# Altium project USBHub.PrjPcb
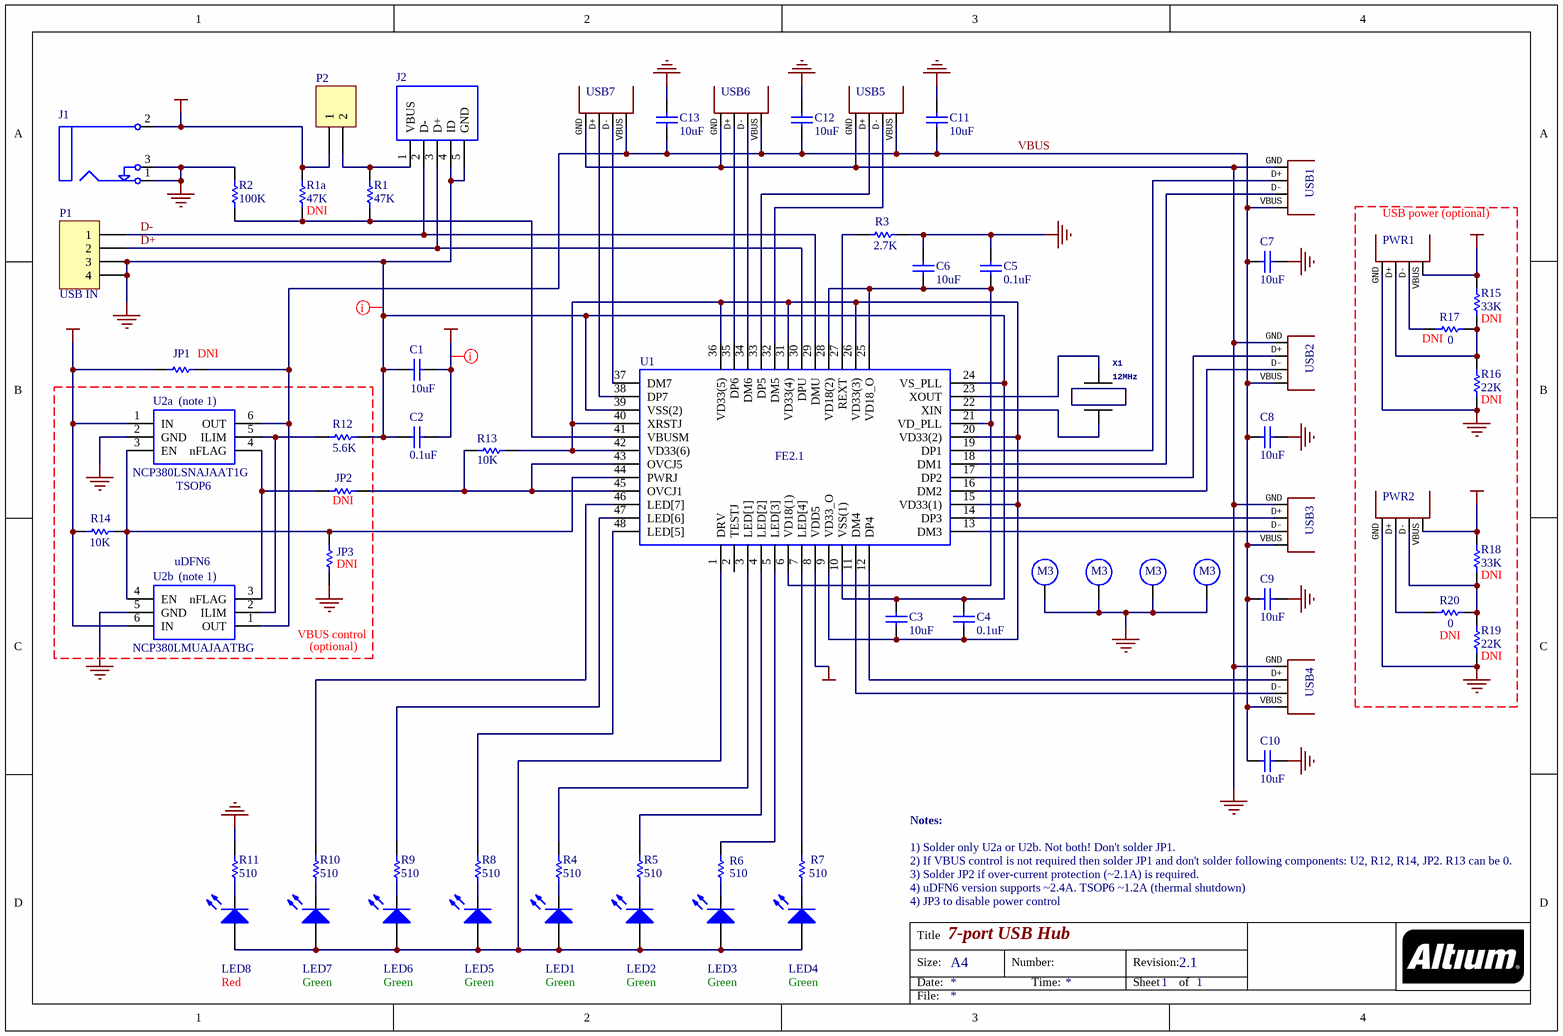
[diagram p0: USBHub.SchDoc]
1 sheet, 66 parts. Net scope: global (net labels, ports and power ports of the same name join across sheets).
Board file: USBHub.PcbDoc

## Sheet USBHub.SchDoc: 7-port USB Hub
size A4; Author: Sorgelig; Revision: 2.1; SheetNumber: 1; SheetTotal: 1

### Parts
C1  value 10uF  [C0805]  (hidden comment: C0805)
C2  value 0.1uF  [C0805]  (hidden comment: C0805)
C3  value 10uF  [C0805]  (hidden comment: C0805)
C4  value 0.1uF  [C0805]  (hidden comment: C0805)
C5  value 0.1uF  [C0805]  (hidden comment: C0805)
C6  value 10uF  [C0805]  (hidden comment: C0805)
C7  value 10uF  [C0805]  (hidden comment: C0805)
C8  value 10uF  [C0805]  (hidden comment: C0805)
C9  value 10uF  [C0805]  (hidden comment: C0805)
C10  value 10uF  [C0805]  (hidden comment: C0805)
C11  value 10uF  [C0805]  (hidden comment: C0805)
C12  value 10uF  [C0805]  (hidden comment: C0805)
C13  value 10uF  [C0805]  (hidden comment: C0805)
H1  M3  [M3]  (value not drawn)
H2  M3  [M3]  (value not drawn)
H3  M3  [M3]  (value not drawn)
H4  M3  [M3]  (value not drawn)
J1  *  [PWR-2mm - DNI]  (value not drawn)
J2  MicroUSB SMT  [MicroUSB SMT v2]  (value not drawn)
JP1  0  [R0805 - DNI]  (value not drawn)
JP2  0  [R0805 - DNI]  (value not drawn)
JP3  0  [R0805 - DNI]  (value not drawn)
LED1  Green  [LEDG0805]
LED2  Green  [LEDG0805]
LED3  Green  [LEDG0805]
LED4  Green  [LEDG0805]
LED5  Green  [LEDG0805]
LED6  Green  [LEDG0805]
LED7  Green  [LEDG0805]
LED8  Red  [LEDR0805]
P1  USB IN  [HDR1X4]
P2  Header 2  [HDR1X2]  (value not drawn)
PWR1  USBA-PTH  [USB-A-F-PTH]  (value not drawn)
PWR2  USBA-PTH  [USB-A-F-PTH]  (value not drawn)
R1  47K  [R0805]
R1a  47K  [R0805 - DNI]
R2  100K  [R0805]
R3  2.7K  [R0805]
R4  510  [R0805]
R5  510  [R0805]
R6  510  [R0805]
R7  510  [R0805]
R8  510  [R0805]
R9  510  [R0805]
R10  510  [R0805]
R11  510  [R0805]
R12  5.6K  [R0805]
R13  10K  [R0805]
R14  10K  [R0805]
R15  33K  [R0805 - DNI]
R16  22K  [R0805 - DNI]
R17  0  [R0805 - DNI]
R18  33K  [R0805 - DNI]
R19  22K  [R0805 - DNI]
R20  0  [R0805 - DNI]
U1  FE2.1  [LQFP48]
U2a  TSOP6  Manufacturer_Part_Number: NCP380LSNAJAAT1G  [SOT23-6_L]
U2b  uDFN6  Manufacturer_Part_Number: NCP380LMUAJAATBG  [uDFN6 2x2mm]
USB1  USBA-PTH  [USB-A-F-PTH]  (value not drawn)
USB2  USBA-PTH  [USB-A-F-PTH]  (value not drawn)
USB3  USBA-PTH  [USB-A-F-PTH]  (value not drawn)
USB4  USBA-PTH  [USB-A-F-PTH]  (value not drawn)
USB5  USBA-PTH  [USB-A-F-PTH]  (value not drawn)
USB6  USBA-PTH  [USB-A-F-PTH]  (value not drawn)
USB7  USBA-PTH  [USB-A-F-PTH]  (value not drawn)
X1  12MHz  [XTAL_G5032]

### Nets
GND: C1.2 C2.2 C3.2 C4.2 C5.2 C6.2 C7.2 C8.2 C9.2 C10.2 C11.2 C12.2 C13.2 H1.1 H2.1 H3.1 H4.1 J1.1 J1.3 J2.4(ID) J2.5(GND) JP3.2 P1.3 P1.4 PWR1.GND PWR2.GND R2.1 R3.2 R11.2 R12.2 R16.2 R19.2 U1.10(VSS(1)) U1.24(VS_PLL) U1.39(VSS(2)) U2a.2(GND) U2b.5(GND) USB1.GND USB2.GND USB3.GND USB4.GND USB5.GND USB6.GND USB7.GND
VCC: C1.1 C2.1 J1.2 JP1.2 P2.1 PWR1.VBUS PWR2.VBUS R1a.1 R14.2 R15.1 R18.1 U1.8(VDD5) U2a.1(IN) U2b.6(IN)
D+: J2.3(D+) P1.2 U1.30(DPU)
D-: J2.2(D-) P1.1 U1.29(DMU)
VBUS: C7.1 C8.1 C9.1 C10.1 C11.1 C12.1 C13.1 JP1.1 U2a.6(OUT) U2b.1(OUT) USB1.VBUS USB2.VBUS USB3.VBUS USB4.VBUS USB5.VBUS USB6.VBUS USB7.VBUS
NetC3_1: C3.1 C4.1 R13.1 U1.9(VD33_O) U1.15(VD33(1)) U1.20(VD33(2)) U1.26(VD33(3)) U1.31(VD33(4)) U1.36(VD33(5)) U1.40(XRSTJ) U1.42(VD33(6))
NetC5_1: C5.1 C6.1 U1.6(VD18(1)) U1.21(VD_PLL) U1.25(VD18_O) U1.28(VD18(2))
NetJ2_1: J2.1(VBUS) P2.2 R1.1
NetJP2_1: JP2.1 R13.2 U1.43(OVCJ5) U1.45(OVCJ1)
NetJP2_2: JP2.2 U2a.4(nFLAG) U2b.3(nFLAG)
NetJP3_1: JP3.1 R14.1 U1.44(PWRJ) U2a.3(EN) U2b.4(EN)
NetLED1_1: LED1.1(A) LED2.1(A) LED3.1(A) LED4.1(A) LED5.1(A) LED6.1(A) LED7.1(A) LED8.1(A) U1.1(DRV)
NetLED1_2: LED1.2(K) R4.2
NetLED2_2: LED2.2(K) R5.2
NetLED3_2: LED3.2(K) R6.2
NetLED4_2: LED4.2(K) R7.2
NetLED5_2: LED5.2(K) R8.2
NetLED6_2: LED6.2(K) R9.2
NetLED7_2: LED7.2(K) R10.2
NetLED8_2: LED8.2(K) R11.1
NetPWR1_D+: PWR1.D+ R15.2 R16.1 R17.2
NetPWR1_D-: PWR1.D- R17.1
NetPWR2_D+: PWR2.D+ R20.1
NetPWR2_D-: PWR2.D- R18.2 R19.1 R20.2
NetR1_2: R1.2 R1a.2 R2.2 U1.41(VBUSM)
NetR3_1: R3.1 U1.27(REXT)
NetR4_1: R4.1 U1.3(LED[1])
NetR5_1: R5.1 U1.4(LED[2])
NetR6_1: R6.1 U1.5(LED[3])
NetR7_1: R7.1 U1.7(LED[4])
NetR8_1: R8.1 U1.48(LED[5])
NetR9_1: R9.1 U1.47(LED[6])
NetR10_1: R10.1 U1.46(LED[7])
NetR12_1: R12.1 U2a.5(ILIM) U2b.2(ILIM)
NetU1_11: U1.11(DM4) USB4.D-
NetU1_12: U1.12(DP4) USB4.D+
NetU1_13: U1.13(DM3) USB3.D-
NetU1_14: U1.14(DP3) USB3.D+
NetU1_16: U1.16(DM2) USB2.D-
NetU1_17: U1.17(DP2) USB2.D+
NetU1_18: U1.18(DM1) USB1.D-
NetU1_19: U1.19(DP1) USB1.D+
NetU1_22: U1.22(XIN) X1.2
NetU1_23: U1.23(XOUT) X1.1
NetU1_32: U1.32(DM5) USB5.D-
NetU1_33: U1.33(DP5) USB5.D+
NetU1_34: U1.34(DM6) USB6.D-
NetU1_35: U1.35(DP6) USB6.D+
NetU1_37: U1.37(DM7) USB7.D-
NetU1_38: U1.38(DP7) USB7.D+

Not connected (* = marked no-connect by the designer): U1 2(TESTJ)

### Layout directives
net class power: GND, VCC

### Notes on the sheet
- (near R1a) DNI
- (near PWR1) USB power (optional)
- (near JP1) DNI
- (near R17) DNI
- (near R15) DNI
- (note 1)
- (near R16) DNI
- (near JP2) DNI
- (near U2b) (note 1)
- (near JP3) DNI
- (near R18) DNI
- VBUS control
- (optional)
- DNI
- (near R19) DNI
- 1) Solder only U2a or U2b. Not both! Don't solder JP1.
- Notes:
- 2) If VBUS control is not required then solder JP1 and don't solder following components: U2, R12, R14, JP2. R13 can be 0.
- 3) Solder JP2 if over-current protection (~2.1A) is required.
- 4) uDFN6 version supports ~2.4A. TSOP6 ~1.2A (thermal shutdown)
- 4) JP3 to disable power control
- Title
- Size:
- Date:
- A4
- Number:
- Time:
- Revision:
- Sheet
- of
- File:

### Library data of the parts
C1-C13 = C0805: Ceramic Chip Capacitor - Standard; Note: Footprint corresponds to dimensions for bulk cassette packaging. This case size has tightened tolerances.; Published: 17-Jul-2002; LatestRevisionDate: 19-Mar-2004; LatestRevisionNote: Silkscreen size reduced.; DatasheetDocument: Mar-2001; PackageDocument: Mar-2001; PackageReference: 0805; Publisher: Altium Limited; Code_JEITA: 0805; Code_IPC: 2012[0805]; ComponentLink1Description: Manufacturer Link; ComponentLink1URL: http://www.kemet.com/; ComponentLink2Description: Datasheet; ComponentLink2URL: http://www.kemet.com/kemet/web/homepage/kechome.nsf/vapubfilesname/F3102TA.pdf/$file/F3102TA.pdf
J1 = Powerjack
J2 = MicroUSB SMT: Micro USB B Receptacle Bottom Mount Assy Molex Right Angle SMT Type B Version 2.0 Micro USB Connector Socket, 30 V ac, 1A 47352 MICRO-USB; Manufacturer_Part_Number: 47346-0001; Allied_Number: 70266948; Manufacturer_Name: Molex; Mouser Part Number: 538-47346-0001; Mouser Price/Stock: https://www.mouser.com/Search/Refine.aspx?Keyword=538-47346-0001; RS Part Number: 7025475P; RS Price/Stock: http://uk.rs-online.com/web/p/products/7025475P; Allied Price/Stock: https://www.alliedelec.com/molex-incorporated-47346-0001/70266948/; Datasheet Link: http://www.molex.com/pdm_docs/sd/473460001_sd.pdf
JP1-JP3 R1 R1a R2-R20 = ERJ6RS: Low Ohmic Value Thick Film Chip Resistor, 0.1 Ohm to 0.2 Ohm Range, 1%, 2% and 5% Tolerance, 0805 Size, 0.125 W; Published: 17-Dec-2003; LatestRevisionDate: 19-Mar-2004; LatestRevisionNote: Silkscreen size reduced.; PackageDocument: Mar-2003; PackageReference: 6-0805; Publisher: Altium Limited; Code_IPC: 2012 [0805]; ComponentLink1Description: Manufacturer Link; ComponentLink1URL: http://www.panasonic.com/industrial/components/resistive_products.htm; ComponentLink2Description: Datasheet; ComponentLink2URL: http://www.panasonic.com/industrial/components/pdf/AOA0000CE3.pdf
LED1-LED8 = LED2: Typical RED, GREEN, YELLOW, AMBER GaAs LED; Published: 8-Jun-2000; LatestRevisionDate: 17-Jul-2002; LatestRevisionNote: Re-released for DXP Platform.; PackageVersion: Feb-2002; PackageReference: 3.2X1.6X1.1; Publisher: Altium Limited; PackageDescription: SM LED; 2 Flat Leads
P1 = Header 4: Header, 4-Pin; LatestRevisionDate: 17-Jul-2002; LatestRevisionNote: Re-released for DXP Platform.; Publisher: Altium Limited
P2 = Header 2: Header, 2-Pin; LatestRevisionDate: 17-Jul-2002; LatestRevisionNote: Re-released for DXP Platform.; Publisher: Altium Limited
U1 = FE2.1_QFP: USB 2.0 HIGH SPEED 7-PORT HUB CONTROLLER; Manufacturer_Name: Terminus Technology; Geometry.Height: 1.6mm; Manufacturer_Part_Number: FE2.1_QFP; RS Part Number: *; RS Price/Stock: *; Datasheet Link: http://www.35ic.net/ui/docs/assets/img/1458708200035.PDF
U2a = NCP380-TSOP6: Manufacturer_Name: ON; Geometry.Height: 1.45mm; Supplier_Name: RS; RS Part Number: *; Allied_Number: *; Other Part Number: *; 3D Package: *
U2b = NCP380-uDFN: Manufacturer_Name: ON; Geometry.Height: 1.45mm; Supplier_Name: RS; RS Part Number: *; Allied_Number: *; Other Part Number: *; 3D Package: *
X1 = CRYSTALHC49UP: PTH: ...   SMD: ...   Cylinder: CMR200T-32.768KDZBT
PWR1 PWR2 USB1-USB7 = USBA-PTH: USB: USB